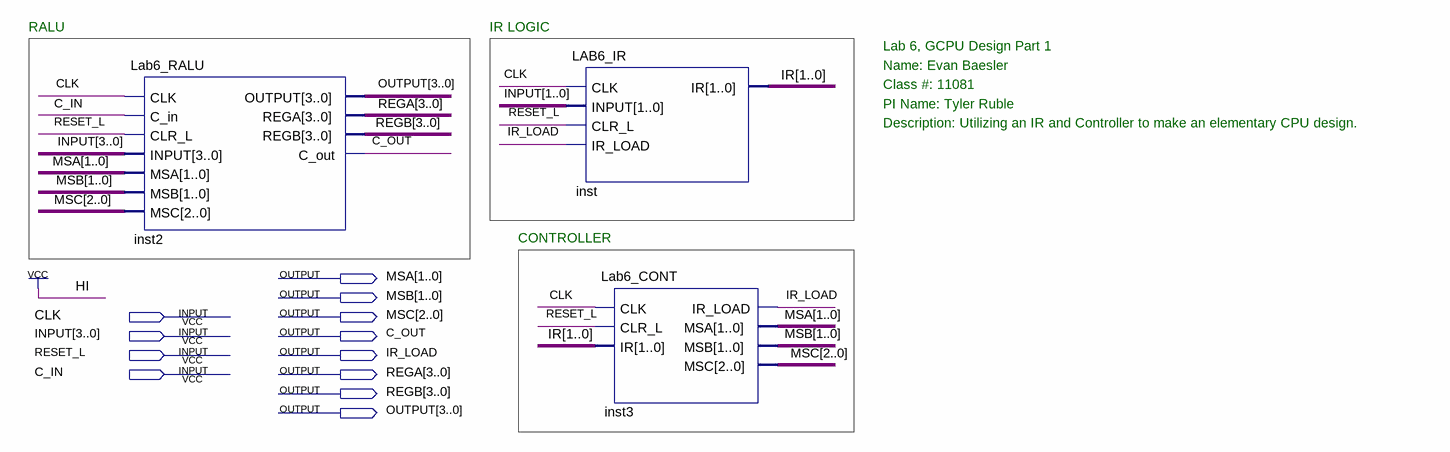
[diagram p0: schematic sheet]
// Quartus schematic Lab6_PART1.bdf as structural Verilog: 3 symbols, 12 pins
module Lab6_PART1 (
  input  CLK,
  input  [3:0] INPUT,
  input  RESET_L,
  input  C_IN,
  output [1:0] MSA,
  output [1:0] MSB,
  output [2:0] MSC,
  output C_OUT,
  output IR_LOAD,
  output [3:0] REGA,
  output [3:0] REGB,
  output [3:0] OUTPUT
);

  wire [1:0] IR;

  Lab6_RALU inst2 (
    .CLK(CLK), .C_in(C_IN), .CLR_L(RESET_L), .INPUT(INPUT), .MSA(MSA), .MSB(MSB), .MSC(MSC), .OUTPUT(OUTPUT),
    .REGA(REGA), .REGB(REGB), .C_out(C_OUT));
  LAB6_IR inst (.CLK(CLK), .INPUT(INPUT[1:0]), .CLR_L(RESET_L), .IR_LOAD(IR_LOAD), .IR(IR));
  Lab6_CONT inst3 (.CLK(CLK), .CLR_L(RESET_L), .IR(IR), .IR_LOAD(IR_LOAD), .MSA(MSA), .MSB(MSB), .MSC(MSC));

  // Notes on the sheet:
  //   RALU
  //   IR LOGIC
  //   Lab 6, GCPU Design Part 1
  //   Name: Evan Baesler
  //   Class #: 11081
  //   PI Name: Tyler Ruble
  //   Description: Utilizing an IR and Controller to make an elementary CPU design.
  //   CONTROLLER
endmodule
